# Altium schematic sheet Safety Devices.SchDoc
size A; SheetNumber: 7; SheetTotal: 9
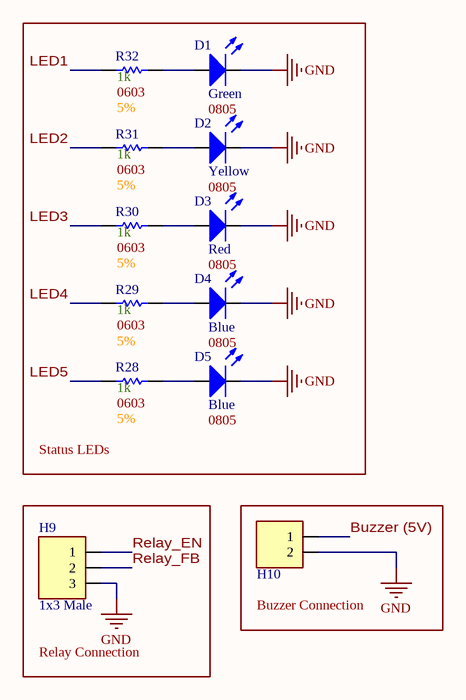
[diagram p0: Safety Devices.SchDoc]

## Parts
D1  Color: Green  Size Package: 0805  [[LED] SMD 0805]  (hidden comment: SMD LED)
D2  Color: Yellow  Size Package: 0805  [[LED] SMD 0805]  (hidden comment: SMD LED)
D3  Color: Red  Size Package: 0805  [[LED] SMD 0805]  (hidden comment: SMD LED)
D4  Color: Blue  Size Package: 0805  [[LED] SMD 0805]  (hidden comment: SMD LED)
D5  Color: Blue  Size Package: 0805  [[LED] SMD 0805]  (hidden comment: SMD LED)
H9  1x3 Male  [[Header] Shrouded 1x3 Male]
H10  1x2 Male  [[Header] Shrouded 1x2 Male]  (value not drawn)
R28  Resistance: 1k  Size Package: 0603  Tolerance: 5%  [[Res] SMD 0603]  (hidden comment: [Res] SMD Resistor)
R29  Resistance: 1k  Size Package: 0603  Tolerance: 5%  [[Res] SMD 0603]  (hidden comment: [Res] SMD Resistor)
R30  Resistance: 1k  Size Package: 0603  Tolerance: 5%  [[Res] SMD 0603]  (hidden comment: [Res] SMD Resistor)
R31  Resistance: 1k  Size Package: 0603  Tolerance: 5%  [[Res] SMD 0603]  (hidden comment: [Res] SMD Resistor)
R32  Resistance: 1k  Size Package: 0603  Tolerance: 5%  [[Res] SMD 0603]  (hidden comment: [Res] SMD Resistor)

## Blocks framed on the sheet
Status LEDs: D1-D5 R28-R32
Relay Connection: H9
Buzzer Connection: H10

## Nets
GND: D1.2(Cathode) D2.2(Cathode) D3.2(Cathode) D4.2(Cathode) D5.2(Cathode) H9.3 H10.2
Buzzer (5V): H10.1
LED1: R32.2
LED2: R31.2
LED3: R30.2
LED4: R29.2
LED5: R28.2
Relay_EN: H9.1
Relay_FB: H9.2
NetD1_1: D1.1(Anode) R32.1
NetD2_1: D2.1(Anode) R31.1
NetD3_1: D3.1(Anode) R30.1
NetD4_1: D4.1(Anode) R29.1
NetD5_1: D5.1(Anode) R28.1

## Library data of the parts
D1-D5 = [LED] SMD: Generic; Part #: *; Supplier 1: DigiKey
  D1: Supplier Part Number 1: 475-LGR971-KN-1CT-ND
  D2: Supplier Part Number 1: 475-LYR976-PS-36-0-20-R18CT-ND
  D3: Supplier Part Number 1: 475-LSR976-NR-1CT-ND
  D4 D5: Supplier Part Number 1: 732-4982-1-ND
H9 = [Header] Shrouded 1x3 Male: 070543-0037 / Mates with 005057-9403; Supplier 1: DigiKey; Supplier 2: DigiKey; Supplier Part Number 1: WM4825-ND; Supplier Part Number 2: WM2901-ND
H10 = [Header] Shrouded 1x2 Male: 0705430036 / Mates with 0050579402; Supplier 1: DigiKey; Supplier 2: DigiKey; Supplier Part Number 2: WM2900-ND; Supplier Part Number 1: WM4824-ND
R28-R32 = [Res] SMD Resistor: Generic; Supplier 1: DigiKey; Supplier Part Number 1: RMCF0603FT1K00DKR-ND